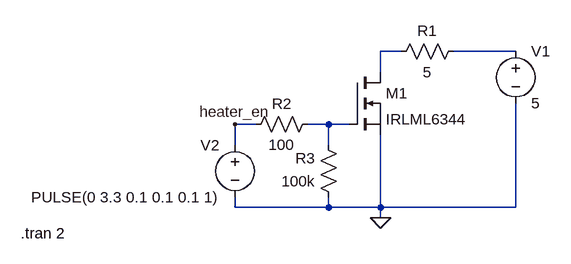
[diagram p0: schematic Heaters.asc]
Heaters.asc, the LTspice schematic file:
Version 4
SHEET 1 880 680
WIRE 240 32 208 32
WIRE 416 32 320 32
WIRE 208 64 208 32
WIRE 16 144 -16 144
WIRE 128 144 96 144
WIRE 160 144 128 144
WIRE -16 176 -16 144
WIRE 128 176 128 144
WIRE -16 272 -16 256
WIRE 128 272 128 256
WIRE 128 272 -16 272
WIRE 208 272 208 160
WIRE 208 272 128 272
WIRE 416 272 416 112
WIRE 416 272 208 272
WIRE 208 288 208 272
FLAG 208 288 0
FLAG -16 144 heater_en
SYMBOL nmos 160 64 R0
SYMATTR InstName M1
SYMATTR Value IRLML6344
SYMBOL res 336 16 R90
WINDOW 0 0 56 VBottom 2
WINDOW 3 32 56 VTop 2
SYMATTR InstName R1
SYMATTR Value 5
SYMBOL res 112 128 R90
WINDOW 0 0 56 VBottom 2
WINDOW 3 32 56 VTop 2
SYMATTR InstName R2
SYMATTR Value 100
SYMBOL res 144 272 R180
WINDOW 0 36 76 Left 2
WINDOW 3 36 40 Left 2
SYMATTR InstName R3
SYMATTR Value 100k
SYMBOL voltage 416 16 R0
SYMATTR InstName V1
SYMATTR Value 5
SYMBOL voltage -16 160 M0
WINDOW 123 0 0 Left 0
WINDOW 39 0 0 Left 0
SYMATTR InstName V2
SYMATTR Value PULSE(0 3.3 0.1 0.1 0.1 1)
TEXT -346 312 Left 2 !.tran 2

The netlist it stands for:
* Heaters.asc
M1 N001 N003 0 0 IRLML6344
R1 N002 N001 5
R2 N003 heater_en 100
R3 0 N003 100k
V1 N002 0 5
V2 heater_en 0 PULSE(0 3.3 0.1 0.1 0.1 1)
.model NMOS NMOS
.model PMOS PMOS
.lib standard.mos
.tran 2
.backanno
.end